# Altium schematic sheet FET Channel.SchDoc
size A
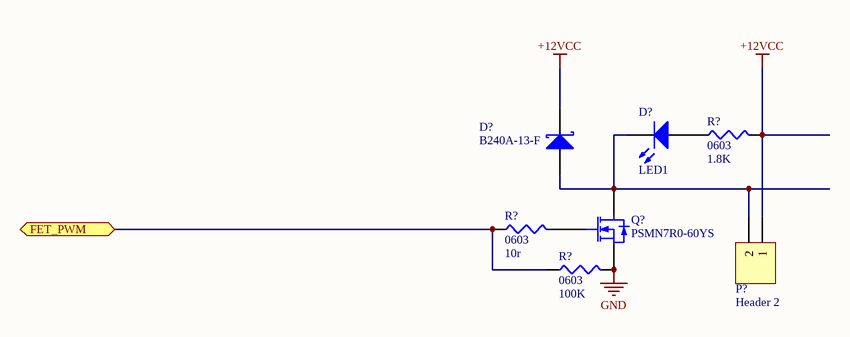
[diagram p0: FET Channel.SchDoc]

## Parts
(Parts that share a designator on the sheet are numbered #1, #2 ... from top to bottom, then left to right.)
D?#1  B240A-13-F  [SMB]
D?#2  LED1  [SM 0805 polarized]
P?  Header 2  [HDR1X2]
Q?  PSMN7R0-60YS  [PSMN7R0-60YS]
R?#1  0603  value 1.8K  [J1-0603]
R?#2  0603  value 10r  [J1-0603]
R?#3  0603  value 100K  [J1-0603]

## Ports
FET_PWM

## Nets
3: Q?.1(S) Q?.2(S)
+12VCC: D?#1.2(K) P?.1 R?#1.2
GND: Q?.3(S) R?#3.2
FET_PWM: R?#2.1 R?#3.1 ; port FET_PWM
NetD?#1_1: D?#1.1(A) D?#2.2(K) P?.2 Q?.5(D)
NetD?#2_1: D?#2.1(A) R?#1.1
NetQ?_4: Q?.4(G) R?#2.2

## Library data of the parts
D?#1 = D Schottky: Schottky Diode; Published: 8-Jun-2000; LatestRevisionDate: 17-Jul-2002; LatestRevisionNote: Re-released for DXP Platform.; PackageReference: SMB; Publisher: Altium Limited; PackageDescription: DO-214-AA/SMB; 2 C-Bend Leads; Body 5.3 x 3.6 mm, inc. leads (LxW); Code_JEDEC: DO-214-AA
D?#2 = LED1: Typical RED GaAs LED; Published: 8-Jun-2000; LatestRevisionDate: 08-Jul-2005; LatestRevisionNote: Mech Layer 1 removed.; PackageReference: LED-1; Publisher: Altium Limited; PackageDescription: LED; 2 Leads
P? = Header 2: Header, 2-Pin; LatestRevisionDate: 17-Jul-2002; LatestRevisionNote: Re-released for DXP Platform.; Publisher: Altium Limited
Q? = PSMN7R0-60YS: N-Channel MOSFET; Published: 8-Jun-2000; LatestRevisionDate: 17-Jul-2002; LatestRevisionNote: Re-released for DXP Platform.; PackageVersion: 1995/1996; PackageReference: E3; Publisher: Altium Limited; PackageDescription: TO, Flat Index; 3 In-Line, Axial Leads; Body Dia. 4.6mm; Lead Dia. 0.5 mm (max)
R?#1-R?#3 = Res3: Resistor; Published: 8-Jun-2000; LatestRevisionDate: 29-May-2009; LatestRevisionNote: IPC-7351 Footprint Added.; PackageReference: J1-0603; Publisher: Altium Limited; PackageDescription: Chip Resistor